# EAGLE schematic IOT_D1-Mini-1_v3 (EAGLE 9.7.0)
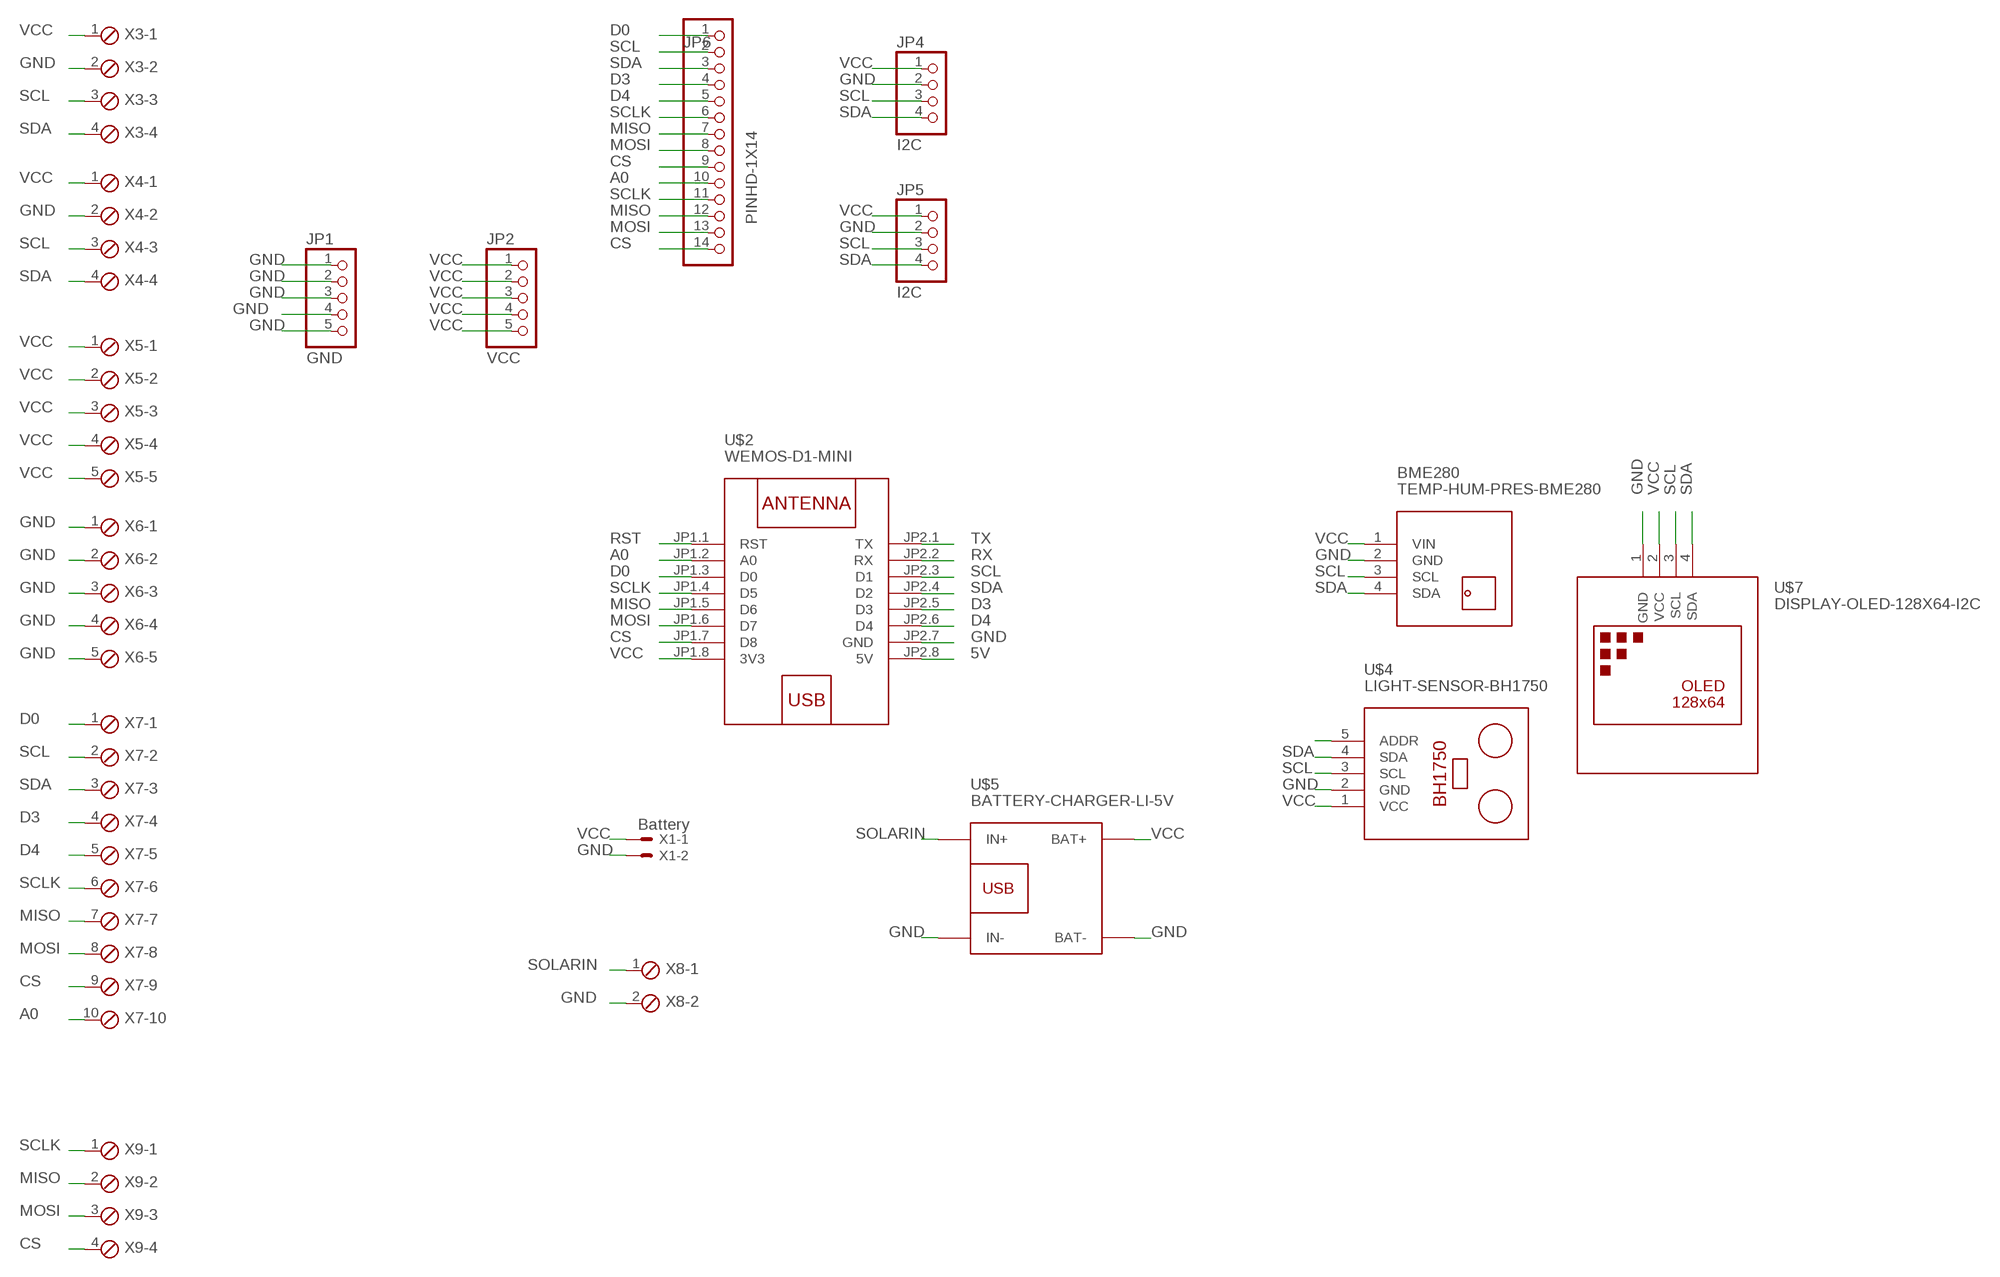
[diagram p0: schematic, sheet 1]

## Parts
BME280  TEMP-HUM-PRES-BME280  [TEMP-HUM-PRES-BME280]
JP1  GND  PINHD-1X5  [1X05]
JP2  VCC  PINHD-1X5  [1X05]
JP4  I2C  PINHD-1X4  [1X04]
JP5  I2C  PINHD-1X4  [1X04]
JP6  PINHD-1X14  [1X14]
U$2  WEMOS-D1-MINI  [WEMOS-D1-MINI]
U$4  LIGHT-SENSOR-BH1750  [LIGHT-SENSOR-BH1750]
U$5  BATTERY-CHARGER-LI-5V  [BATTERY-CHARGER-LI-5V]
U$7  DISPLAY-OLED-128X64-I2C  [DISPLAY-OLED-128X64-I2C]
X1  Battery  53047-02  [53047-02]
X3  MPT4  [4POL254]
X4  MPT4  [4POL254]
X5  MPT5  [5POL254]
X6  MPT5  [5POL254]
X7  MPT10  [10POL254]
X8  MPT2  [2POL254]
X9  MPT4  [4POL254]

## Nets
5V: U$2.JP2.8(5V)
A0: JP6.10 U$2.JP1.2(A0) X7.10
CS: JP6.9 JP6.14 U$2.JP1.7(D8) X7.9 X9.4
D0: JP6.1 U$2.JP1.3(D0) X7.1
D3: JP6.4 U$2.JP2.5(D3) X7.4
D4: JP6.5 U$2.JP2.6(D4) X7.5
GND: BME280.2(GND) JP1.1 JP1.2 JP1.3 JP1.4 JP1.5 JP4.2 JP5.2 U$2.JP2.7(GND) U$4.2(GND) U$5.BAT- U$5.IN- U$7.1(GND) X1.2 X3.2 X4.2 X6.1 X6.2 X6.3 X6.4 X6.5 X8.2
MISO: JP6.7 JP6.12 U$2.JP1.5(D6) X7.7 X9.2
MOSI: JP6.8 JP6.13 U$2.JP1.6(D7) X7.8 X9.3
N$10: U$4.5(ADDR)
RST: U$2.JP1.1(RST)
RX: U$2.JP2.2(RX)
SCL: BME280.3(SCL) JP4.3 JP5.3 JP6.2 U$2.JP2.3(D1) U$4.3(SCL) U$7.3(SCL) X3.3 X4.3 X7.2
SCLK: JP6.6 JP6.11 U$2.JP1.4(D5) X7.6 X9.1
SDA: BME280.4(SDA) JP4.4 JP5.4 JP6.3 U$2.JP2.4(D2) U$4.4(SDA) U$7.4(SDA) X3.4 X4.4 X7.3
SOLARIN: U$5.IN+ X8.1
TX: U$2.JP2.1(TX)
VCC: BME280.1(VIN) JP2.1 JP2.2 JP2.3 JP2.4 JP2.5 JP4.1 JP5.1 U$2.JP1.8(3V3) U$4.1(VCC) U$5.BAT+ U$7.2(VCC) X1.1 X3.1 X4.1 X5.1 X5.2 X5.3 X5.4 X5.5

## Library data of the parts
BME280 = diy-modules (2):TEMP-HUM-PRES-BME280: Digital Humidity-Temperature-Pressure Sensor based on BME280 device More information about BME280 device is available here: https://www.bosch-sensortec.com/bst/products/all_products/bme280 Click here to find device on ebay.com <http://www.ebay.com/sch/bme280+breakout>
JP1 JP2 = Connector:PINHD-1X5: PIN HEADER; CATEGORY: CONNECTOR; SUB-CATEGORY: PIN-HEADER
JP4 JP5 = Connector:PINHD-1X4: PIN HEADER; CATEGORY: CONNECTOR; SUB-CATEGORY: PIN-HEADER
JP6 = Connector:PINHD-1X14: PIN HEADER; CATEGORY: CONNECTOR; SUB-CATEGORY: PIN-HEADER
U$2 = diy-modules:WEMOS-D1-MINI: WEMOS D1 mini: Mini Wi-Fi Board based on ESP-8266 device More details can be found here: https://www.wemos.cc/product/d1-mini.html Click here to find device on ebay.com <http://www.ebay.com/sch/wemos+d1+mini+nodemcu>
U$4 = diy-modules (2):LIGHT-SENSOR-BH1750: Digital Light Sensor based on BH1750 BH1750 datasheet is available here: http://www.mouser.com/ds/2/348/bh1750fvi-e-186247.pdf Arduino Library for BH1750 is available here: https://github.com/claws/BH1750 Video Tutorial is available here: https://www.youtube.com/watch?v=UsLcHSbxf_8 Click here to find device on ebay.com <http://www.ebay.com/sch/bh1750fvi+module> Note: There are many variants. Search for the proper version.
U$5 = diy-modules (2):BATTERY-CHARGER-LI-5V: Lithium Battery 5V Charger More details available here: http://www.buildcircuit.com/how-to-use-micro-usb-5v-1a-lithium-battery-charging-board-charger-module/ Click here to find device on ebay.com <http://www.ebay.com/sch/tp4056+charger+usb>
U$7 = diy-modules:DISPLAY-OLED-128X64-I2C: 128x64 Dot Matrix OLED Module based on SSD1306 chip Variant with I2C interface More details available here: http://www.instructables.com/id/Monochrome-096-i2c-OLED-display-with-arduino-SSD13/ SSD1306 datasheet: https://cdn-shop.adafruit.com/datasheets/SSD1306.pdf Click here to find device on ebay.com <http://www.ebay.com/sch/oled+display+128x64+iic> Note: There are two variants: I2C and SPI. Search for the proper version.
X1 = con-molex:53?-02: CONNECTOR wire to board 1.25 mm (.049 inch) pitch header; MF: MOLEX; MPN: 53047-0210; OC_FARNELL: 9733051; OC_NEWARK: 57H4701
X3 X4 X9 = con-phoenix-254:MPT4: PHOENIX CONNECTOR; OC_FARNELL: unknown; OC_NEWARK: unknown
X5 X6 = con-phoenix-254:MPT5: PHOENIX CONNECTOR; OC_FARNELL: unknown; OC_NEWARK: unknown
X7 = con-phoenix-254:MPT10: PHOENIX CONNECTOR; OC_FARNELL: unknown; OC_NEWARK: unknown
X8 = con-phoenix-254:MPT2: PHOENIX CONNECTOR; OC_FARNELL: unknown; OC_NEWARK: unknown